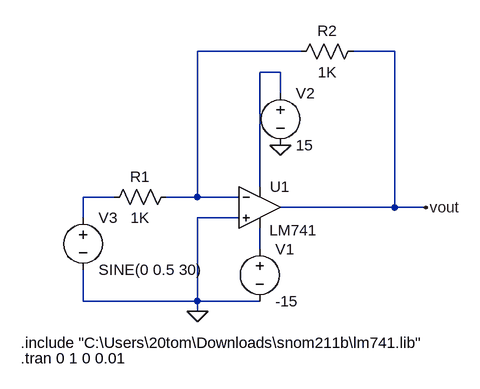
[diagram p0: schematic EXP5 - INV.asc]
EXP5 - INV.asc, the LTspice schematic file:
Version 4.1
SHEET 1 880 680
WIRE 288 -80 128 -80
WIRE 432 -80 368 -80
WIRE 256 -48 224 -48
WIRE 256 -16 256 -48
WIRE 224 128 224 -48
WIRE 0 144 -48 144
WIRE 128 144 128 -80
WIRE 128 144 80 144
WIRE 192 144 128 144
WIRE 432 160 432 -80
WIRE 432 160 256 160
WIRE 480 160 432 160
WIRE -48 176 -48 144
WIRE 192 176 128 176
WIRE 224 224 224 192
WIRE -48 304 -48 256
WIRE 128 304 128 176
WIRE 128 304 -48 304
WIRE 224 304 128 304
WIRE 128 320 128 304
FLAG 256 64 0
FLAG 128 320 0
FLAG 480 160 vout
SYMBOL OpAmps\\opamp2 224 96 R0
WINDOW 3 15 99 Left 2
SYMATTR Value LM741
SYMATTR InstName U1
SYMBOL voltage 224 208 R0
WINDOW 123 0 0 Left 0
WINDOW 39 0 0 Left 0
SYMATTR InstName V1
SYMATTR Value -15
SYMBOL voltage 256 -32 R0
WINDOW 123 0 0 Left 0
WINDOW 39 0 0 Left 0
SYMATTR InstName V2
SYMATTR Value 15
SYMBOL voltage -48 160 R0
WINDOW 123 0 0 Left 0
WINDOW 39 0 0 Left 0
SYMATTR InstName V3
SYMATTR Value SINE(0 0.5 30)
SYMBOL res 96 128 R90
WINDOW 0 0 56 VBottom 2
WINDOW 3 32 56 VTop 2
SYMATTR InstName R1
SYMATTR Value 1K
SYMBOL res 384 -96 R90
WINDOW 0 0 56 VBottom 2
WINDOW 3 32 56 VTop 2
SYMATTR InstName R2
SYMATTR Value 1K
TEXT -144 368 Left 2 !.include "C:\\Users\\20tom\\Downloads\\snom211b\\lm741.lib"
TEXT -144 392 Left 2 !.tran 0 1 0 0.01

The netlist it stands for:
* EXP5 - INV.asc
X§U1 0 N001 N002 N004 vout LM741  ; pins In+ In- V+ V- OUT
V1 N004 0 -15
V2 N002 0 15
V3 N003 0 SINE(0 0.5 30)
R1 N001 N003 1K
R2 vout N001 1K
.include "C:\Users\20tom\Downloads\snom211b\lm741.lib"
.tran 0 1 0 0.01
.backanno
.end